# Altium schematic sheet JH_Con_board.SchDoc
size A4; SheetNumber: 1; SheetTotal: 3
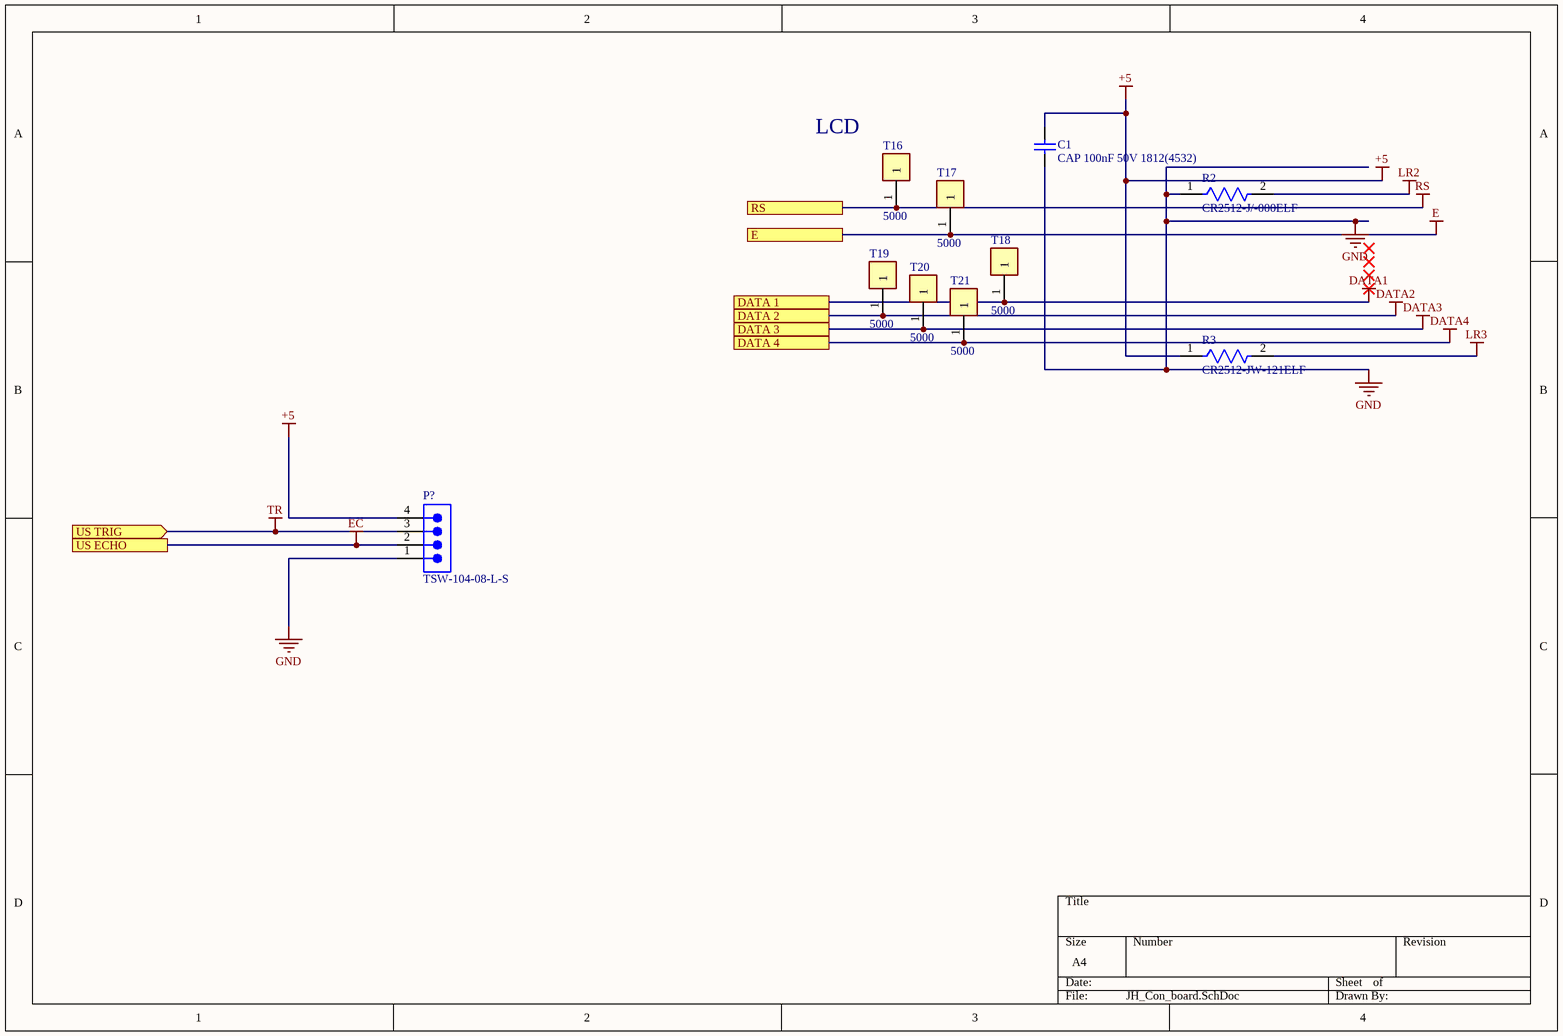
[diagram p0: JH_Con_board.SchDoc]

## Parts
C1  CAP 100nF 50V 1812(4532)  [CAPC1812(4532)100_M]
P?  TSW-104-08-L-S  [SMTC-TSW-104-08-X-S]
R2  CR2512-J/-000ELF  [FP-CR2512-IPC_C]
R3  CR2512-JW-121ELF  [FP-CR2512-IPC_C]
T16  5000  [FP-5000-MFG]
T17  5000  [FP-5000-MFG]
T18  5000  [FP-5000-MFG]
T19  5000  [FP-5000-MFG]
T20  5000  [FP-5000-MFG]
T21  5000  [FP-5000-MFG]

## Ports
DATA 1, DATA 2, DATA 3, DATA 4, E, RS, US ECHO, US TRIG (in)

## Nets
+5: C1.2 P?.4 R3.1
DATA1: T18.1 ; port DATA 1
DATA2: T19.1 ; port DATA 2
DATA3: T20.1 ; port DATA 3
DATA4: T21.1 ; port DATA 4
E: T17.1 ; port E
EC: P?.2 ; port US ECHO
GND: C1.1 P?.1 R2.1
LR2: R2.2
LR3: R3.2
RS: T16.1 ; port RS
TR: P?.3 ; port US TRIG

## Notes on the sheet
- LCD

## Library data of the parts
C1 = CMP-1040-01293-1: CAP 100nF 50V ±20% 1812 (4532 Metric) Thickness 1mm SMD; Case-Metric: 4532; Tolerance: Â±20%; Case-EIA: 1812; Rated Voltage: 50 V; Value: 100nF; Max Thickness: 1 mm; Technology: SMT
P? = CMP-1024-00358-1: 0.025" SQ Post Header, Through-hole, Vertical, -55 to 125 degC, 2.54 mm Pitch, 4-Pin, Male, RoHS; Manufacturer: Samtec; Pitch: 2.54 mm; PartNumber: TSW-104-08-L-S; RoHS: True; Temperature Range: -55 to 125 degC; PackageDescription: .025[0.64] SQ. Post Terminal Strip Assembly; Orientation: Vertical; ComponentLink2URL: http://www.samtec.com/documents/webfiles/pdf/TSW_TH.PDF; ComponentLink1Description: Manufacturer URL; ComponentLink2Description: Datasheet; PackageVersion: DM, 8/1988; ComponentLink3URL: http://www.samtec.com/documents/webfiles/cpdf/TSW-XXX-XX-XXX-X-XX-XXX-MKT.pdf; Mounting Technology: Through-hole; PackageReference: TSW-104-08-X-S; ComponentLink3Description: Package Specification; ComponentLink1URL: http://www.samtec.com; DatasheetVersion: F-214
R2 = CMP-07231-001301-1: Thick Film Chip Resistors 2512 0Ω 1W 5%; Resistance: 0mR; Voltage Rating: 200V; Temperature Coefficient: 500ppm/°C; Max Operating Temperature: 155°C; Depth: 3.1mm; Case Code (Metric): 6332; REACH SVHC: No SVHC; Packaging: Tape and Reel; Min Operating Temperature: -55°C; Case Code (Imperial): 2512; Power Rating: 1W; Composition: Thick Film; Radiation Hardening: No; Contact Plating: Tin; Military Standard: Not; Termination: SMD/SMT; Max Power Dissipation: 1W; Tolerance: 5%; Mount: Surface Mount; Case/Package: 2512; Voltage Rating (DC): 200V; Length: 6.3mm
R3 = CMP-07231-004395-1: Thick Film Chip Resistors 2512 120Ω 1W 5% 200ppm/°C; Resistance: 120R; Max Power Dissipation: 1W; Height: 0.03inch; Case/Package: 2512; Tolerance: 5%; Max Operating Temperature: 155°C; Depth: 3.1mm; Mount: Surface Mount; Number of Terminations: 2; Packaging: Tape and Reel; Package Quantity: 4000; Min Operating Temperature: -55°C; Temperature Coefficient: 200ppm/°C; Composition: Thick Film; Length: 0.248inch; Power Rating: 1W; Width: 0.122inch; Military Standard: Not
T16-T21 = CMP-19636-000027-1: PC TEST POINT MINIATURE RED; Outside Diameter: 2.54mm; Body Material: Bronze; Number of Contacts: 1; Insulation: Insulated; Inside Diameter: 1.27mm; Hole Diameter: 1.6mm; Plating: Silver; Material: Nylon; Length: 7.62mm; Package Quantity: 100; Number of Ports: 1; Contact Material: Bronze; Orientation: Straight; RoHS Compliant: Yes; Housing Color: Red; Height: 0.3inch; Series: THM; Lead Free: Lead Free; Color: Red; Contact Plating: Tin; Mount: PCB; Packaging: Bulk; REACH SVHC: No SVHC; Flammability Rating: UL94 V-0